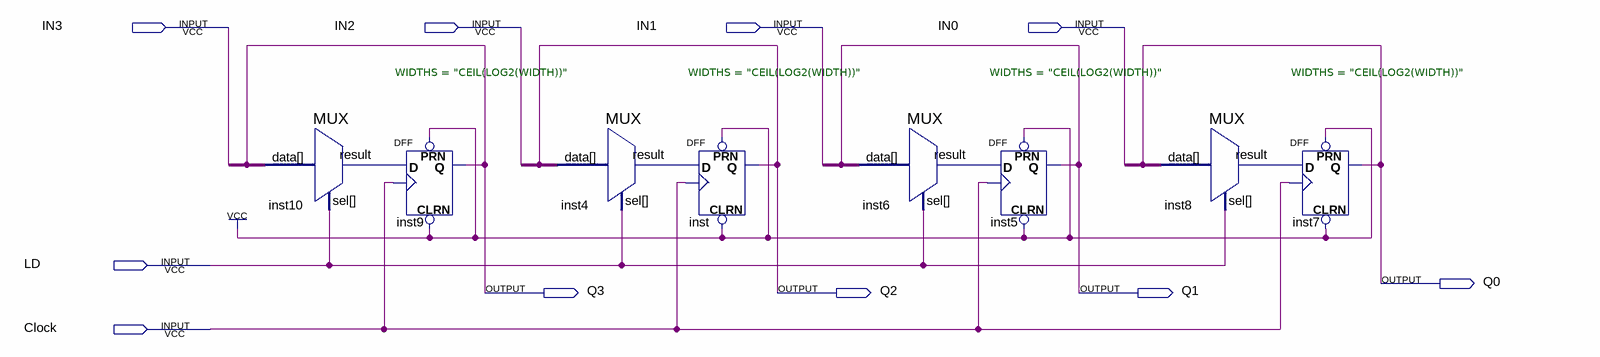
[diagram p0: schematic sheet]
// Quartus schematic 4bit_register.bdf as structural Verilog: 8 symbols, 10 pins
module \4bit_register  (
  input  IN3,
  input  IN2,
  input  IN1,
  input  IN0,
  input  LD,
  input  Clock,
  output Q0,
  output Q3,
  output Q2,
  output Q1
);

  wire inst4_result, inst6_result, inst8_result, inst10_result, undriven, undriven_2, undriven_3, undriven_4;

  MUX #(.WIDTHS("CEIL(LOG2(WIDTH))")) inst10 (.data(undriven_4), .sel(LD), .result(inst10_result));
  DFF inst9 (.CLRN(1'b1), .CLK(Clock), .D(inst10_result), .PRN(1'b1), .Q(Q3));
  MUX #(.WIDTHS("CEIL(LOG2(WIDTH))")) inst4 (.data(undriven), .sel(LD), .result(inst4_result));
  DFF inst (.CLRN(1'b1), .CLK(Clock), .D(inst4_result), .PRN(1'b1), .Q(Q2));
  MUX #(.WIDTHS("CEIL(LOG2(WIDTH))")) inst6 (.data(undriven_2), .sel(LD), .result(inst6_result));
  DFF inst5 (.CLRN(1'b1), .CLK(Clock), .D(inst6_result), .PRN(1'b1), .Q(Q1));
  MUX #(.WIDTHS("CEIL(LOG2(WIDTH))")) inst8 (.data(undriven_3), .sel(LD), .result(inst8_result));
  DFF inst7 (.CLRN(1'b1), .CLK(Clock), .D(inst8_result), .PRN(1'b1), .Q(Q0));
endmodule
